# Altium schematic sheet Sheet1.SchDoc
size A3; SheetNumber: 1; SheetTotal: 1
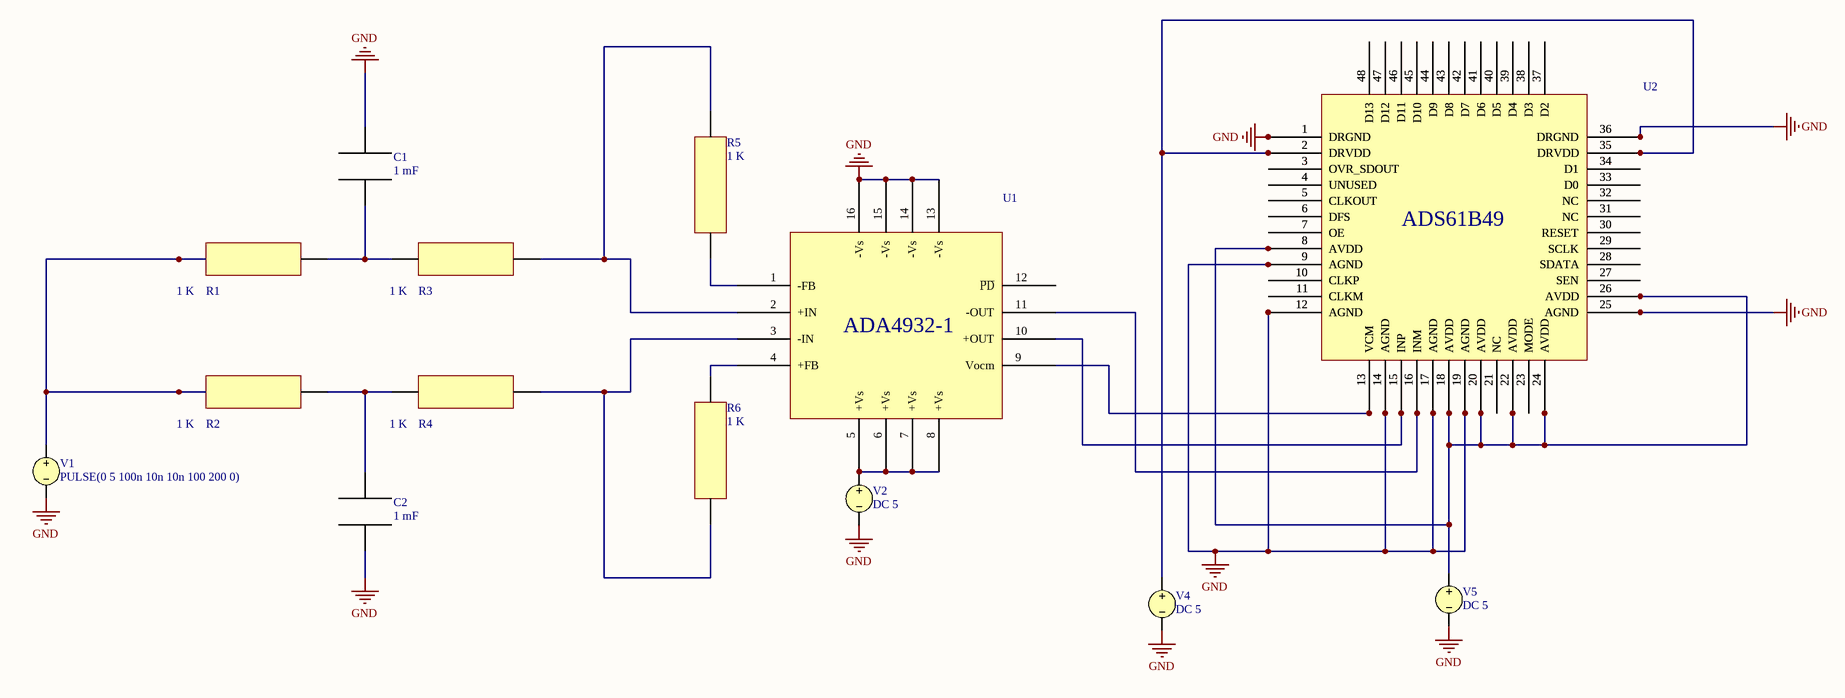
[diagram p0: Sheet1.SchDoc]

## Parts
C1  Capacitance: 1 mF  [PCB_C]  (hidden comment: Capacitor)
C2  Capacitance: 1 mF  [PCB_C]  (hidden comment: Capacitor)
R1  Resistance: 1 K  [PCB_R]  (hidden comment: Resistor)
R2  Resistance: 1 K  [PCB_R]  (hidden comment: Resistor)
R3  Resistance: 1 K  [PCB_R]  (hidden comment: Resistor)
R4  Resistance: 1 K  [PCB_R]  (hidden comment: Resistor)
R5  Resistance: 1 K  [PCB_R]  (hidden comment: Resistor)
R6  Resistance: 1 K  [PCB_R]  (hidden comment: Resistor)
U1  Operational_amplifier  [PCB_OA]  (value not drawn)
U2  Analog-to-Digital_Converter  [PCB_ADC]  (value not drawn)
V1  PULSE(0 5 100n 10n 10n 100 200 0)
V2  DC 5
V4  DC 5
V5  DC 5

## Nets
GND: C1.2 C2.1 U1.13(-Vs) U1.14(-Vs) U1.15(-Vs) U1.16(-Vs) U2.1(DRGND) U2.9(AGND) U2.12(AGND) U2.14(AGND) U2.17(AGND) U2.19(AGND) U2.25(AGND) U2.36(DRGND) V1.2 V2.2 V4.2 V5.2
NetC1_1: C1.1 R1.2 R3.1
NetC2_2: C2.2 R2.2 R4.1
NetR1_1: R1.1 R2.1 V1.1
NetR3_2: R3.2 R5.2 U1.2(+IN)
NetR4_2: R4.2 R6.1 U1.3(-IN)
NetR5_1: R5.1 U1.1(-FB)
NetR6_2: R6.2 U1.4(+FB)
NetU1_5: U1.5(+Vs) U1.6(+Vs) U1.7(+Vs) U1.8(+Vs) V2.1
NetU1_9: U1.9(Vocm) U2.13(VCM)
NetU1_10: U1.10(+OUT) U2.15(INP)
NetU1_11: U1.11(-OUT) U2.16(INM)
NetU2_2: U2.2(DRVDD) U2.35(DRVDD) V4.1
NetU2_8: U2.8(AVDD) U2.18(AVDD) U2.20(AVDD) U2.22(AVDD) U2.24(AVDD) U2.26(AVDD) V5.1

Not connected (* = marked no-connect by the designer): U1 12(P̅D̅); U2 3(OVR_SDOUT) 4(UNUSED) 5(CLKOUT) 6(DFS) 7(OE) 10(CLKP) 11(CLKM) 21(NC) 23(MODE) 27(SEN) 28(SDATA) 29(SCLK) 30(RESET) 31(NC) 32(NC) 33(D0) 34(D1) 37(D2) 38(D3) 39(D4) 40(D5) 41(D6) 42(D7) 43(D8) 44(D9) 45(D10) 46(D11) 47(D12) 48(D13)

## Notes on the sheet
- (in symbol Analog-to-Digital_Converter) ADS61B49
- (in symbol Operational_amplifier) ADA4932-1

## Library data of the parts
V1 = VSRC: Voltage Source; Note: PCB Footprint - Not required; AC Magnitude: 2; AC Phase: 0; Pulsed Value: 5; Pulse Width: 100; Period: 200; Published: 8-Jun-2000; LatestRevisionDate: 17-Jul-2002; LatestRevisionNote: Re-released for DXP Platform.; PackageReference: Not Applicable; Publisher: Altium Limited; DC Magnitude: 0; Initial Value: 0; Time Delay: 100n; Rise Time: 10n; Fall Time: 10n; Phase: 0
V2 V4 V5 = VSRC: Voltage Source; Note: PCB Footprint - Not required; AC Magnitude: 1; AC Phase: 0; Value: 5; Published: 8-Jun-2000; LatestRevisionDate: 17-Jul-2002; LatestRevisionNote: Re-released for DXP Platform.; PackageReference: Not Applicable; Publisher: Altium Limited